# EasyEDA Pro project 课设PCB设计.eprj

# Schematic Schematic1
Board Name: Board1; Create Date: 2025-07-07; Page Name: P1; Project Name: 课设PCB设计; Schematic Name: Schematic1; Update Date: 2025-07-07; Company: 嘉立创EDA; Page Size: A4; Version: V1.0
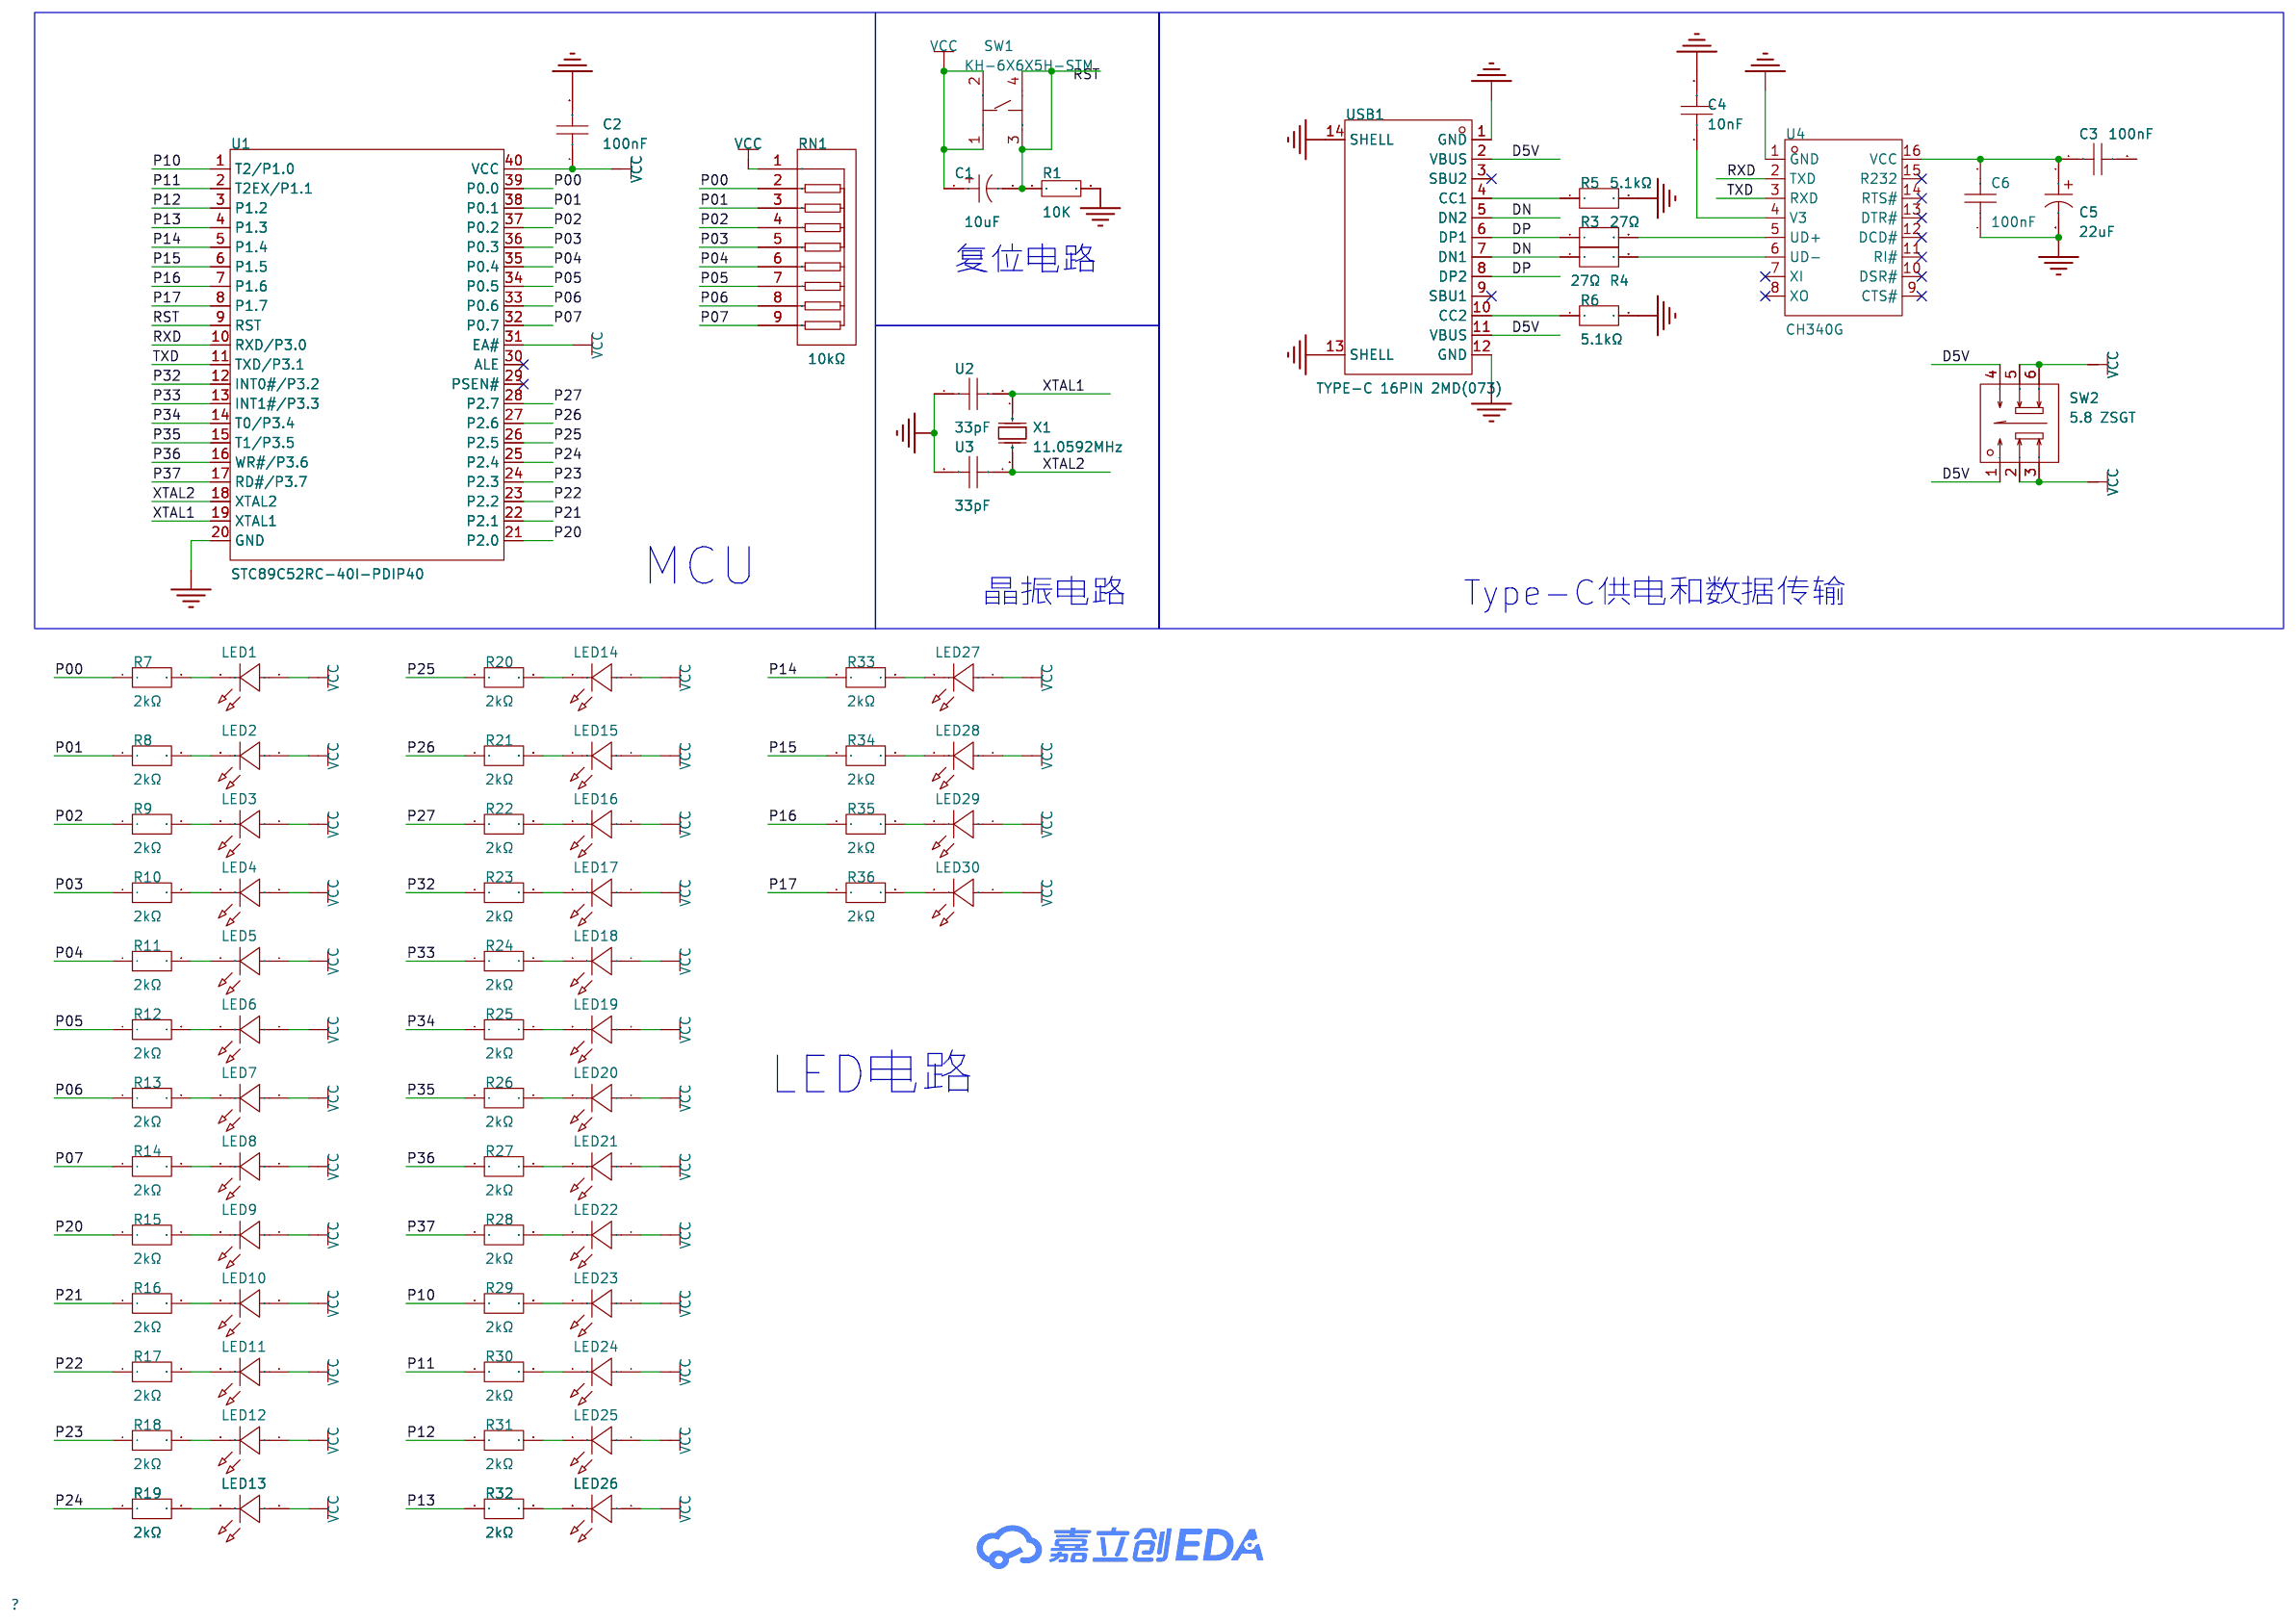
[diagram p0: schematic sheet]

## Parts
C1  10uF  [CAP-TH_BD10.0-P5.00-D0.6-FD_1]
C2  100nF  [C0603]
C3  100nF  [C0603]
C4  10nF  [C0603]
C5  22uF  [CAP-SMD_BD5.0-L5.3-W5.3-LS6.0-FD-H5.7]
C6  100nF  [C0603]
LED1  L-7113SGC  [LED-TH_BD5.9-P2.54-FD]
LED2  L-7113SGC  [LED-TH_BD5.9-P2.54-FD]
LED3  L-7113SGC  [LED-TH_BD5.9-P2.54-FD]
LED4  L-7113SGC  [LED-TH_BD5.9-P2.54-FD]
LED5  L-7113SGC  [LED-TH_BD5.9-P2.54-FD]
LED6  L-7113SGC  [LED-TH_BD5.9-P2.54-FD]
LED7  L-7113SGC  [LED-TH_BD5.9-P2.54-FD]
LED8  L-7113SGC  [LED-TH_BD5.9-P2.54-FD]
LED9  L-7113SGC  [LED-TH_BD5.9-P2.54-FD]
LED10  L-7113SGC  [LED-TH_BD5.9-P2.54-FD]
LED11  L-7113SGC  [LED-TH_BD5.9-P2.54-FD]
LED12  L-7113SGC  [LED-TH_BD5.9-P2.54-FD]
LED13  L-7113SGC  [LED-TH_BD5.9-P2.54-FD]
LED14  L-7113SGC  [LED-TH_BD5.9-P2.54-FD]
LED15  L-7113SGC  [LED-TH_BD5.9-P2.54-FD]
LED16  L-7113SGC  [LED-TH_BD5.9-P2.54-FD]
LED17  L-7113SGC  [LED-TH_BD5.9-P2.54-FD]
LED18  L-7113SGC  [LED-TH_BD5.9-P2.54-FD]
LED19  L-7113SGC  [LED-TH_BD5.9-P2.54-FD]
LED20  L-7113SGC  [LED-TH_BD5.9-P2.54-FD]
LED21  L-7113SGC  [LED-TH_BD5.9-P2.54-FD]
LED22  L-7113SGC  [LED-TH_BD5.9-P2.54-FD]
LED23  L-7113SGC  [LED-TH_BD5.9-P2.54-FD]
LED24  L-7113SGC  [LED-TH_BD5.9-P2.54-FD]
LED25  L-7113SGC  [LED-TH_BD5.9-P2.54-FD]
LED26  L-7113SGC  [LED-TH_BD5.9-P2.54-FD]
LED27  L-7113SGC  [LED-TH_BD5.9-P2.54-FD]
LED28  L-7113SGC  [LED-TH_BD5.9-P2.54-FD]
LED29  L-7113SGC  [LED-TH_BD5.9-P2.54-FD]
LED30  L-7113SGC  [LED-TH_BD5.9-P2.54-FD]
R1  10K  [R0603]
R3  27Ω  [R0805]
R4  27Ω  [R0805]
R5  5.1kΩ  [R0603]
R6  5.1kΩ  [R0603]
R7  2kΩ  [R0402]
R8  2kΩ  [R0402]
R9  2kΩ  [R0402]
R10  2kΩ  [R0402]
R11  2kΩ  [R0402]
R12  2kΩ  [R0402]
R13  2kΩ  [R0402]
R14  2kΩ  [R0402]
R15  2kΩ  [R0402]
R16  2kΩ  [R0402]
R17  2kΩ  [R0402]
R18  2kΩ  [R0402]
R19  2kΩ  [R0402]
R20  2kΩ  [R0402]
R21  2kΩ  [R0402]
R22  2kΩ  [R0402]
R23  2kΩ  [R0402]
R24  2kΩ  [R0402]
R25  2kΩ  [R0402]
R26  2kΩ  [R0402]
R27  2kΩ  [R0402]
R28  2kΩ  [R0402]
R29  2kΩ  [R0402]
R30  2kΩ  [R0402]
R31  2kΩ  [R0402]
R32  2kΩ  [R0402]
R33  2kΩ  [R0402]
R34  2kΩ  [R0402]
R35  2kΩ  [R0402]
R36  2kΩ  [R0402]
RN1  10kΩ  [RES-ARRAY-TH_9P-P2.54-D1.0]
SW1  KH-6X6X5H-STM  [SW-SMD_4P-L6.0-W6.0-P4.50-LS9.0_H5.0]
SW2  5.8 ZSGT  [SW-TH_5.8ZSGT]
U1  STC89C52RC-40I-PDIP40  [DIP-40_L52.0-W13.7-P2.54-LS15.2-BL]
U2  33pF  [C0603]
U3  33pF  [C0603]
U4  CH340G  [SOIC-16_L9.9-W3.9-P1.27-LS6.0-BL]
USB1  TYPE-C 16PIN 2MD(073)  [USB-C-SMD_TYPE-C-6PIN-2MD-073]
X1  11.0592MHz  [HC-49US_L11.5-W4.5-P4.88]

## Library data of the parts
C1 = CV100MPA16B: 容值:10uF;精度:±20%;额定电压:450V;纹波电流:200mA@100kHz;等效串联电阻(ESR):9Ω@100kHz;; LCSC Part Name: 10uF ±20% 450V; Supplier Part: C911241; Manufacturer: TWBOR(伯鸿); Supplier Footprint: 插件,D10xL16mm; JLCPCB Part Class: 扩展库; Datasheet: https://atta.szlcsc.com/upload/public/pdf/source/20201117/C911241_08C53D140102C9DE5D4425A5E1B3FE4F.pdf; Supplier: LCSC; Tolerance: ±20%; Voltage Rating: 450V; Ripple Current: 200mA@100kHz; Equivalent Series Resistance(ESR): 9Ω@100kHz; Pin Spacing: 5mm; Diameter: 10mm; Height - Seated (Max): 16mm; Lifetime: 5000hrs@105℃; Operating Temperature: -25℃~+105℃
C2 C3 C6 = 0603X7R104K250NT: 容值:100nF;精度:±10%;额定电压:25V;温度系数:X7R;; LCSC Part Name: 100nF ±10% 25V; Supplier Part: C48579280; Manufacturer: AIDE(爱迪电容); Supplier Footprint: 0603; JLCPCB Part Class: 扩展库; Datasheet: https://atta.szlcsc.com/upload/public/pdf/source/20210330/C2691711_5D01E1D4D7BF54205139C8425089DFE9.pdf; Supplier: LCSC; Tolerance: ±10%; Voltage Rating: 25V; Temperature Coefficient: X7R
C4 = C0603X103K2RECAUTO: 容值:10nF;精度:±10%;额定电压:200V;温度系数:X7R;; LCSC Part Name: 10nF ±10% 200V; Supplier Part: C2179446; Manufacturer: KEMET(基美); Supplier Footprint: 0603; JLCPCB Part Class: 扩展库; Datasheet: https://atta.szlcsc.com/upload/public/pdf/source/20210401/9EB15DD54C62581D346AFC10D664EB43.pdf; Supplier: LCSC; Tolerance: ±10%; Voltage Rating: 200V; Temperature Coefficient: X7R
C5 = JVE35V22M5X6: 容值:22uF;精度:±20%;额定电压:35V;纹波电流:95mA@120Hz;等效串联电阻(ESR):1.8Ω;; LCSC Part Name: 22uF ±20% 35V; Supplier Part: C48615118; Manufacturer: 捷而瑞; Supplier Footprint: SMD,D5xL5.7mm; JLCPCB Part Class: 扩展库; Datasheet: https://atta.szlcsc.com/upload/public/pdf/source/20250526/77E8EF678E4424190D47C2A54E1D535C.pdf; Supplier: LCSC; Tolerance: ±20%; Voltage Rating: 35V; Ripple Current: 95mA@120Hz; Equivalent Series Resistance(ESR): 1.8Ω; Diameter: 5mm; Height - Seated (Max): 5.7mm; Operating Temperature: -55℃~+105℃
LED1-LED30 = L-7113SGC: Supplier Part: C598455; Manufacturer: Kingbright; Supplier Footprint: 插件; JLCPCB Part Class: 扩展库; Datasheet: https://atta.szlcsc.com/upload/public/pdf/source/20250423/1662BB5EE7BFA789B9DB59295C7166F0.pdf; Supplier: LCSC
R1 = Res_0603: Supplier Footprint: 0603
R3 R4 = FRC0805J270 TS: 电阻类型:厚膜电阻;阻值:27Ω;精度:±5%;功率:125mW;工作电压:150V;温度系数:±100ppm/℃;; LCSC Part Name: 27Ω ±5% 125mW 厚膜电阻; Supplier Part: C2907314; Manufacturer: FOJAN(富捷); Supplier Footprint: 0805; JLCPCB Part Class: 扩展库; Datasheet: https://atta.szlcsc.com/upload/public/pdf/source/20211221/925EC7D7225764EE0046F22065062C87.pdf; Supplier: LCSC; Type: 厚膜电阻; Tolerance: ±5%; Power(Watts): 125mW; Voltage-Supply(Max): 150V; Temperature Coefficient: ±100ppm/℃; Operating Temperature: -55℃~+155℃
R5 R6 = RNCF0603TKW5K10: 电阻类型:薄膜电阻;阻值:5.1kΩ;精度:±0.01%;功率:100mW;温度系数:±2ppm/℃;; LCSC Part Name: 薄膜电阻 5.1kΩ ±0.01% 100mW; Supplier Part: C5863831; Manufacturer: SEI(Stackpole Electronics Inc.); Supplier Footprint: 0603; JLCPCB Part Class: 扩展库; Datasheet: https://atta.szlcsc.com/upload/public/pdf/source/20240328/A43EC6CDE744F29FBC58E37E114A4DE1.pdf; Supplier: LCSC; Type: 薄膜电阻; Tolerance: ±0.01%; Power(Watts): 100mW; Temperature Coefficient: ±2ppm/℃; Operating Temperature: -55℃~+155℃
R7-R36 = RCS04022K00FKED: LCSC Part Name: 厚膜电阻 2kΩ ±1% 200mW; Supplier Part: C2085948; Manufacturer: VISHAY(威世); Supplier Footprint: 0402; Datasheet: https://atta.szlcsc.com/upload/public/pdf/source/20210503/0CC639779AE1E6CD65C23C0020C9E501.pdf; Supplier: LCSC; Type: 厚膜电阻; Tolerance: ±1%; Power(Watts): 200mW; Voltage-Supply(Max): 50V; Temperature Coefficient: ±100ppm/℃; Operating Temperature: -55℃~+155℃
RN1 = 排阻 10 K 5%: LCSC Part Name: 10KΩ (103) ±5%; Supplier Part: C26615; Supplier Footprint: 插件; JLCPCB Part Class: 扩展库; Supplier: LCSC
SW1 = KH-6X6X5H-STM: 电路结构:单刀单掷;按钮形状:圆形按钮;安装方式:立贴;开关长度:6mm;开关宽度:6mm;开关高度:5mm;带支架:不带;触点电流:50mA;额定电压(DC):12V;机械寿命:8万次;; LCSC Part Name: 6*6*5mm 立贴 轻触开关; Supplier Part: C2837531; Manufacturer: kinghelm(金航标); Supplier Footprint: SMD; JLCPCB Part Class: 扩展库; Datasheet: https://atta.szlcsc.com/upload/public/pdf/source/20210608/C2837531_45E87AB996CE723B09405FF2EA209C4C.pdf; Supplier: LCSC; Circuit: 单刀单掷; Actuator Style: 圆形按钮; Mounting Style: 立贴; Switch Length: 6mm; Switch Width: 6mm; Switch Height: 5mm; Strike Gundam: 不带; Contact Current: 50mA; Voltage Rating (DC): 12V; Actuator/Cap Color: 黑色; Pin Style: 鸥翼型; Mechanical Life: 8万次
SW2 = 5.8 ZSGT: 电路结构:双刀双掷;自锁/无锁:自锁;安装方式:直插;触点电流:110mA;额定电压 (DC):30V;带灯:不带;作用力:1.5N;机械寿命:10万次;; LCSC Part Name: 5.8*5.8有头/高头 带锁/自锁开关 泡泡机开关; Supplier Part: C2681587; Manufacturer: SHOU HAN(首韩); Supplier Footprint: 插件; JLCPCB Part Class: 扩展库; Datasheet: https://atta.szlcsc.com/upload/public/pdf/source/20210107/C2681587_CDDDDA4A1C7AC9FEB01815B75893A6BA.pdf; Supplier: LCSC; Circuit: 双刀双掷; Self Lock / No Lock: 自锁; Actuator Style: 方形按钮; Mounting Style: 直插; Contact Current: 110mA; Voltage Rating (DC): 30V; Insulation Resistance: 100MΩ; Actuator/Cap Color: 白色; With Lamp: 不带; Pin Style: PC引脚; Operating Force: 1.5N; Operating Temperature: -10℃~+70℃; Mechanical Life: 10万次
U1 = STC89C52RC-40I-PDIP40: Supplier Part: C14022; Manufacturer: STC; Supplier Footprint: DIP-40; JLCPCB Part Class: 扩展库; Datasheet: https://atta.szlcsc.com/upload/public/pdf/source/20250219/C2F0DDDE7C5E9ADA5B33742D18630F09.pdf; Supplier: LCSC; CPU Core: 51系列; Program Storage Size: 8KB; Program Memory Type: FLASH; Number of I/O: 35; Voltage - Supply: 3.3V~5.5V
U2 U3 = GRM1885C1H330FA01D: 容值:33pF;精度:±1%;额定电压:50V;温度系数:-;; LCSC Part Name: 33pF ±1% 50V; Supplier Part: C882522; Manufacturer: muRata(村田); Supplier Footprint: 0603; JLCPCB Part Class: 扩展库; Datasheet: https://atta.szlcsc.com/upload/public/pdf/source/20200305/C490387_23319AE8C154DEB24C505E6C82A8106A.pdf; Supplier: LCSC; Tolerance: ±1%; Voltage Rating: 50V
U4 = CH340G: 应用功能:USB转UART;接口协议:USB 2.0;数据速率:2Mbps;; LCSC Part Name: USB转串口芯片CH340; Supplier Part: C14267; Manufacturer: WCH(南京沁恒); Supplier Footprint: SOP-16; JLCPCB Part Class: 扩展库; Datasheet: https://atta.szlcsc.com/upload/public/pdf/source/20240313/8510303D24D987FBF1AD30058571F10E.pdf; Supplier: LCSC; Applications Function: USB转UART; Protocol: USB 2.0; Supply Voltage: 5V；3.3V; Data Rate: 2Mbps; Operating Temperature: -40℃~+85℃
USB1 = TYPE-C 16PIN 2MD(073): 连接器类型:Type-C;协议标准:USB 3.1;公母:母;安装方式:卧贴;触点数量:16P;端口数量:1;额定电流 - 电源:3A;工作温度:-25℃~+85℃;; LCSC Part Name: Type-C 母 卧贴; Supplier Part: C2765186; Manufacturer: SHOU HAN(首韩); Supplier Footprint: SMD; JLCPCB Part Class: 扩展库; Datasheet: https://atta.szlcsc.com/upload/public/pdf/source/20250506/FFB74EDFDFA0AC372CE4A8E4F739CCEF.pdf; Supplier: LCSC; Connector Type: Type-C; Protocol Standard: USB 3.1; Gender: 母; Mounting Type: 卧贴; Number of Contacts: 16P; Number of Ports: 1; Current Rating-Power: 3A; Voltage Rating: 5V; Connect-Disconnect Life: 5千次; Detection color: 黑色; Operating Temperature: -25℃~+85℃
X1 = X49SD110592MSD2SC: 晶振类型:直插晶振;频率:11.0592MHz;常温频差:±20ppm;负载电容:20pF;频率稳定度:±30ppm;; LCSC Part Name: HC-49US 11.0592MHZ 2P 49S 20PF ±20PPM -20~70℃（±30PPM）; Supplier Part: C2203; Manufacturer: YXC(扬兴晶振); Supplier Footprint: HC-49S; JLCPCB Part Class: 扩展库; Datasheet: https://atta.szlcsc.com/upload/public/pdf/source/20240329/977D7F2434F98B2BE33270BB9FF3D86D.pdf; Supplier: LCSC; Type: 直插晶振; Normal temperature Frequency Tolerance: ±20ppm; Load Capacitance: 20pF; Frequency Stability: ±30ppm; Operating Temperature: -20℃~+70℃

## Nets
D5V: SW2.1 SW2.4 USB1.2(VBUS) USB1.11(VBUS)
GND: C2.2 C4.2 C5.2 C6.1 R1.2 R5.2 R6.2 U1.20(GND) U2.1 U3.2 U4.1(GND) USB1.1(GND) USB1.12(GND) USB1.13(SHELL) USB1.14(SHELL)
VCC: C1.1 C2.1 LED1.1 LED2.1 LED3.1 LED4.1 LED5.1 LED6.1 LED7.1 LED8.1 LED9.1 LED10.1 LED11.1 LED12.1 LED13.1 LED14.1 LED15.1 LED16.1 LED17.1 LED18.1 LED19.1 LED20.1 LED21.1 LED22.1 LED23.1 LED24.1 LED25.1 LED26.1 LED27.1 LED28.1 LED29.1 LED30.1 RN1.1 SW1.1 SW1.2 SW2.2 SW2.3 SW2.5 SW2.6 U1.31(EA#) U1.40(VCC)
DN: R4.1 USB1.5(DN2) USB1.7(DN1)
DP: R3.1 USB1.6(DP1) USB1.8(DP2)
P00: R7.1 RN1.2 U1.39(P0.0)
P01: R8.1 RN1.3 U1.38(P0.1)
P02: R9.1 RN1.4 U1.37(P0.2)
P03: R10.1 RN1.5 U1.36(P0.3)
P04: R11.1 RN1.6 U1.35(P0.4)
P05: R12.1 RN1.7 U1.34(P0.5)
P06: R13.1 RN1.8 U1.33(P0.6)
P07: R14.1 RN1.9 U1.32(P0.7)
P10: R29.1 U1.1(T2/P1.0)
P11: R30.1 U1.2(T2EX/P1.1)
P12: R31.1 U1.3(P1.2)
P13: R32.1 U1.4(P1.3)
P14: R33.1 U1.5(P1.4)
P15: R34.1 U1.6(P1.5)
P16: R35.1 U1.7(P1.6)
P17: R36.1 U1.8(P1.7)
P20: R15.1 U1.21(P2.0)
P21: R16.1 U1.22(P2.1)
P22: R17.1 U1.23(P2.2)
P23: R18.1 U1.24(P2.3)
P24: R19.1 U1.25(P2.4)
P25: R20.1 U1.26(P2.5)
P26: R21.1 U1.27(P2.6)
P27: R22.1 U1.28(P2.7)
P32: R23.1 U1.12(INT0#/P3.2)
P33: R24.1 U1.13(INT1#/P3.3)
P34: R25.1 U1.14(T0/P3.4)
P35: R26.1 U1.15(T1/P3.5)
P36: R27.1 U1.16(WR#/P3.6)
P37: R28.1 U1.17(RD#/P3.7)
RST: C1.2 R1.1 SW1.3 SW1.4 U1.9(RST)
RXD: U1.10(RXD/P3.0) U4.2(TXD)
TXD: U1.11(TXD/P3.1) U4.3(RXD)
XTAL1: U1.19(XTAL1) U2.2 X1.1(OSC1)
XTAL2: U1.18(XTAL2) U3.1 X1.2(OSC2)
$1N1798: R5.1 USB1.4(CC1)
$1N1799: R6.1 USB1.10(CC2)
$1N1802: R3.2 U4.5(UD+)
$1N1803: R4.2 U4.6(UD-)
$1N1804: C4.1 U4.4(V3)
$1N1817: C3.1 C5.1 C6.2 U4.16(VCC)
$1N1968: LED1.2 R7.2
$1N2162: LED2.2 R8.2
$1N2248: LED3.2 R9.2
$1N2334: LED4.2 R10.2
$1N2420: LED5.2 R11.2
$1N2506: LED6.2 R12.2
$1N2592: LED7.2 R13.2
$1N2678: LED8.2 R14.2
$1N2764: LED9.2 R15.2
$1N2850: LED10.2 R16.2
$1N2936: LED11.2 R17.2
$1N3022: LED12.2 R18.2
$1N3108: LED13.2 R19.2
$1N4130: LED14.2 R20.2
$1N4137: LED15.2 R21.2
$1N4144: LED16.2 R22.2
$1N4151: LED17.2 R23.2
$1N4158: LED18.2 R24.2
$1N4165: LED19.2 R25.2
$1N4172: LED20.2 R26.2
$1N4179: LED21.2 R27.2
$1N4186: LED22.2 R28.2
$1N4193: LED23.2 R29.2
$1N4200: LED24.2 R30.2
$1N4207: LED25.2 R31.2
$1N4214: LED26.2 R32.2
$1N4546: LED27.2 R33.2
$1N4553: LED28.2 R34.2
$1N4560: LED29.2 R35.2
$1N4567: LED30.2 R36.2

Not connected (* = marked no-connect by the designer): C3 2; U1 29(PSEN#)* 30(ALE)*; U4 7(XI)* 8(XO)* 9(CTS#)* 10(DSR#)* 11(RI#)* 12(DCD#)* 13(DTR#)* 14(RTS#)* 15(R232)*; USB1 3(SBU2)* 9(SBU1)*

## Notes on the sheet
- 复位电路
- MCU
- 晶振电路
- Type-C供电和数据传输
- LED电路

# Board PCB1
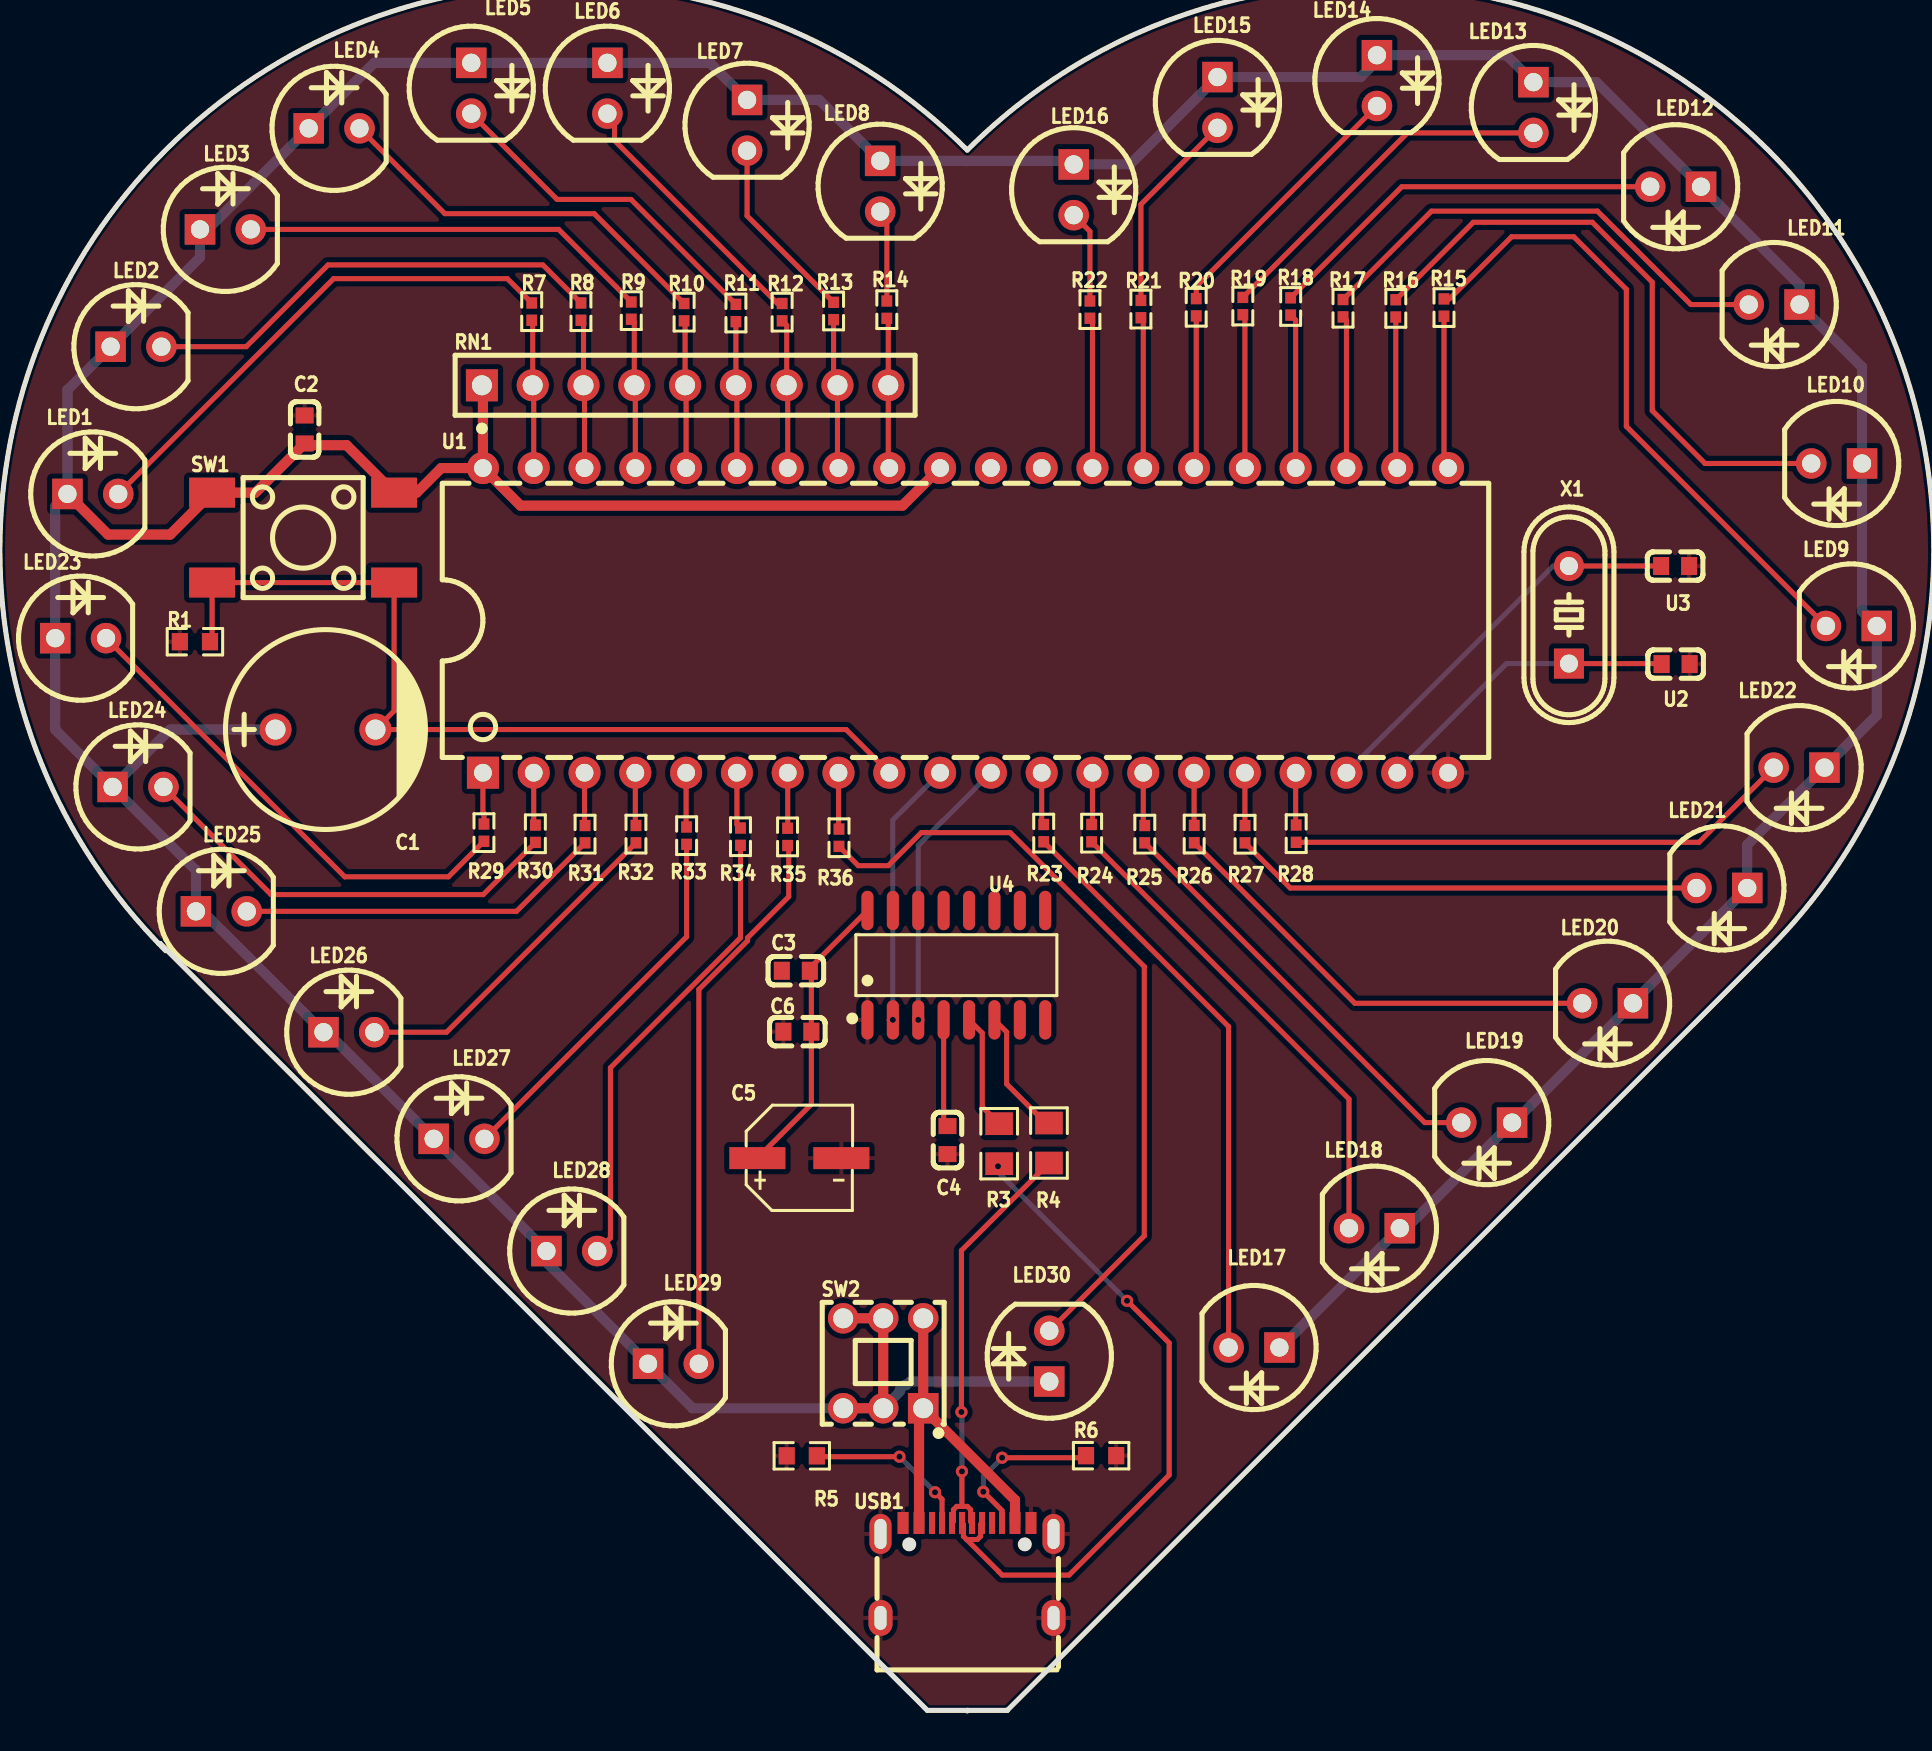
[diagram p1: board, top side]
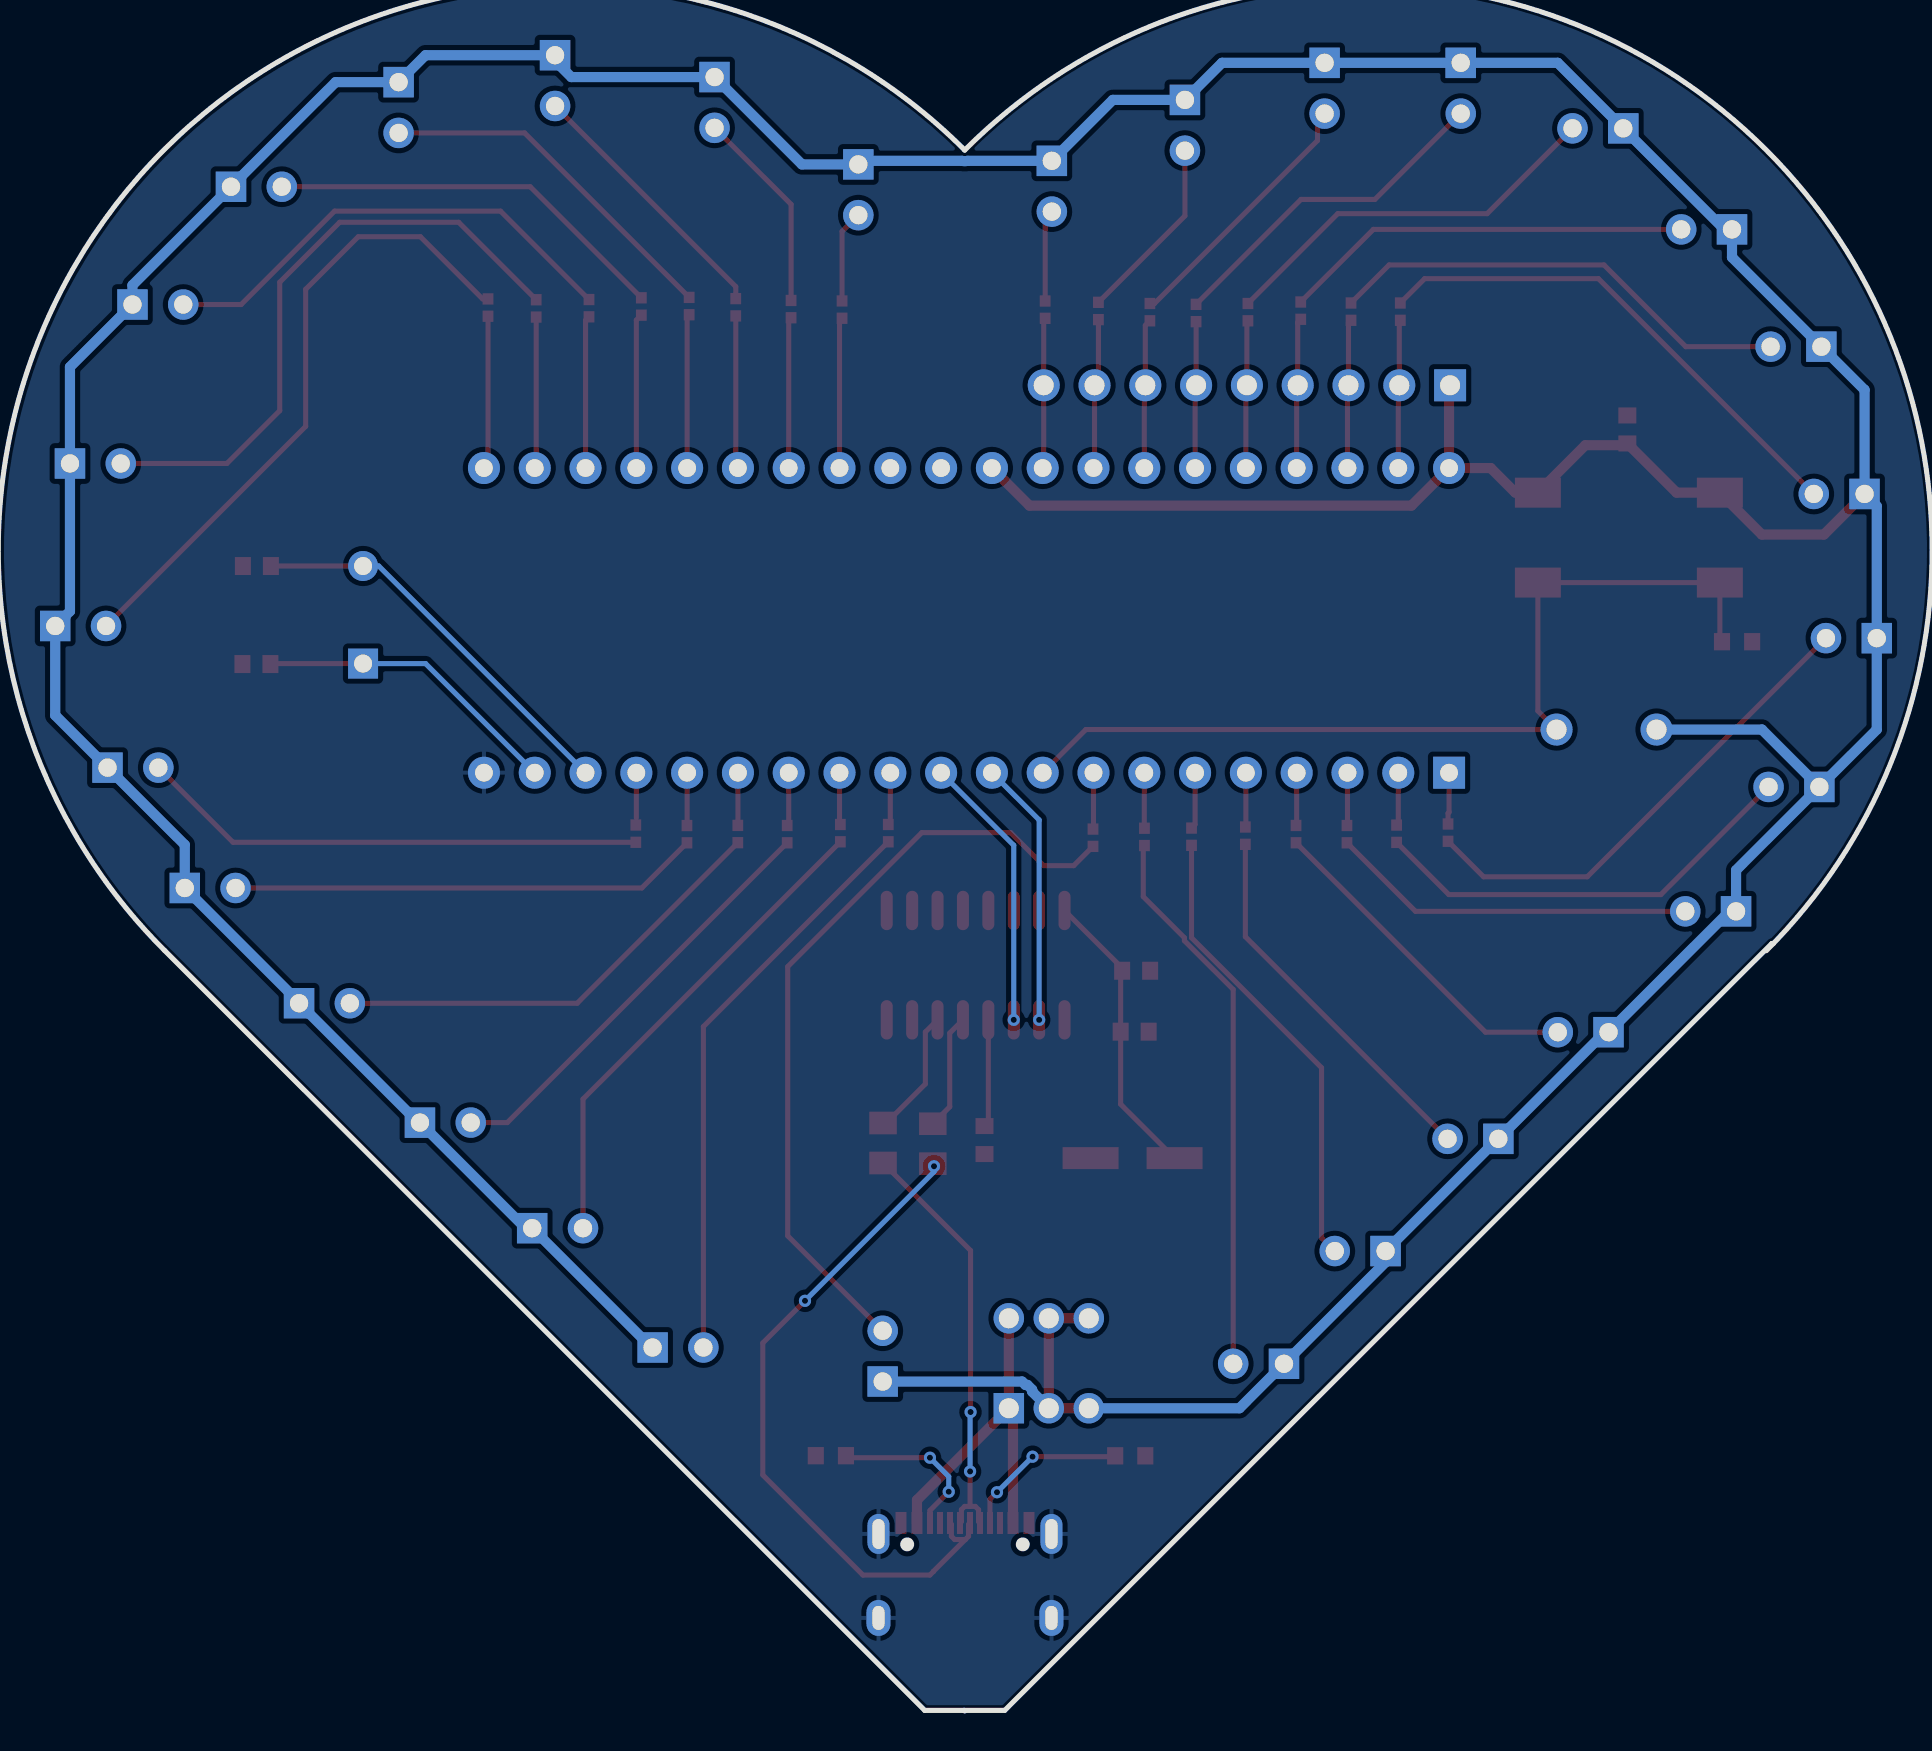
[diagram p2: board, bottom side, seen from below]

Outline 96.67 x 86.39 mm; copper layers: Top Layer, Bottom Layer. Coordinates in mm from the lower left corner of the outline.
Outline path: 7.93,38.39 8.01,38.39 46.37,0.03 48.4,0.03 ; 8.28,38.03 arc(8.3,78.1) 48.37,78.08 arc(88.39,78.05) 88.37,38.03 50.37,0.03 50.37,0.03 48.4,0.03 ; 48.37,0 48.4,0.03
Stack: Top Layer 0.035mm / Dielectric1 1.51mm FR4 er 4.5 / Bottom Layer 0.035mm

## Design rules (mm)
template: JLCPCB Capability(Two Layers Board)
spacing copperThickness1oz (default): track to track 0.102, other pairs 0.152 to 0.3
spacing copperThickness2oz: track to track 0.203, other pairs 0.152 to 0.3
track width copperThickness1oz (default): min 0.127, default 0.254, max 2.54
track width copperThickness2oz: min 0.203, default 0.254, max 2.54
differential pair differentialPair (default): width min 0.127, default 0.254, max 2.54; gap min 0.152, default 0.152
via viaSize (default): diameter min 0.5, default 0.61, max 10; hole min 0.3, default 0.305, max 6.3

## Placement (name value [footprint] x y rotation side)
C1  10uF  [CAP-TH_BD10.0-P5.00-D0.6-FD_1]  16.27 49.09 0 top
C2  100nF  [C0603]  15.23 64.11 90 top
C3  100nF  [C0603]  39.8 37.03 180 top
C4  10nF  [C0603]  47.38 28.56 270 top
C5  22uF  [CAP-SMD_BD5.0-L5.3-W5.3-LS6.0-FD-H5.7]  39.97 27.66 0 top
C6  100nF  [C0603]  39.87 33.98 0 top
LED1  L-7113SGC  [LED-TH_BD5.9-P2.54-FD]  4.64 60.88 0 top
LED2  L-7113SGC  [LED-TH_BD5.9-P2.54-FD]  6.8 68.25 0 top
LED3  L-7113SGC  [LED-TH_BD5.9-P2.54-FD]  11.27 74.11 0 top
LED4  L-7113SGC  [LED-TH_BD5.9-P2.54-FD]  16.71 79.17 0 top
LED5  L-7113SGC  [LED-TH_BD5.9-P2.54-FD]  23.56 81.17 270 top
LED6  L-7113SGC  [LED-TH_BD5.9-P2.54-FD]  30.37 81.17 270 top
LED7  L-7113SGC  [LED-TH_BD5.9-P2.54-FD]  37.36 79.32 270 top
LED8  L-7113SGC  [LED-TH_BD5.9-P2.54-FD]  44.01 76.27 270 top
LED9  L-7113SGC  [LED-TH_BD5.9-P2.54-FD]  92.58 54.28 180 top
LED10  L-7113SGC  [LED-TH_BD5.9-P2.54-FD]  91.84 62.4 180 top
LED11  L-7113SGC  [LED-TH_BD5.9-P2.54-FD]  88.72 70.35 180 top
LED12  L-7113SGC  [LED-TH_BD5.9-P2.54-FD]  83.79 76.25 180 top
LED13  L-7113SGC  [LED-TH_BD5.9-P2.54-FD]  76.68 80.21 270 top
LED14  L-7113SGC  [LED-TH_BD5.9-P2.54-FD]  68.85 81.56 270 top
LED15  L-7113SGC  [LED-TH_BD5.9-P2.54-FD]  60.88 80.46 270 top
LED16  L-7113SGC  [LED-TH_BD5.9-P2.54-FD]  53.69 76.09 270 top
LED17  L-7113SGC  [LED-TH_BD5.9-P2.54-FD]  62.71 18.18 180 top
LED18  L-7113SGC  [LED-TH_BD5.9-P2.54-FD]  68.73 24.15 180 top
LED19  L-7113SGC  [LED-TH_BD5.9-P2.54-FD]  74.34 29.43 180 top
LED20  L-7113SGC  [LED-TH_BD5.9-P2.54-FD]  80.38 35.4 180 top
LED21  L-7113SGC  [LED-TH_BD5.9-P2.54-FD]  86.1 41.17 180 top
LED22  L-7113SGC  [LED-TH_BD5.9-P2.54-FD]  89.96 47.19 180 top
LED23  L-7113SGC  [LED-TH_BD5.9-P2.54-FD]  4.03 53.67 0 top
LED24  L-7113SGC  [LED-TH_BD5.9-P2.54-FD]  6.9 46.22 0 top
LED25  L-7113SGC  [LED-TH_BD5.9-P2.54-FD]  11.07 40 0 top
LED26  L-7113SGC  [LED-TH_BD5.9-P2.54-FD]  17.44 33.96 0 top
LED27  L-7113SGC  [LED-TH_BD5.9-P2.54-FD]  22.95 28.62 0 top
LED28  L-7113SGC  [LED-TH_BD5.9-P2.54-FD]  28.59 23.01 0 top
LED29  L-7113SGC  [LED-TH_BD5.9-P2.54-FD]  33.67 17.37 0 top
LED30  L-7113SGC  [LED-TH_BD5.9-P2.54-FD]  52.47 17.75 90 top
R1  10K  [R0603]  9.75 53.49 180 top
R3  27Ω  [R0805]  49.96 28.38 90 top
R4  27Ω  [R0805]  52.45 28.41 90 top
R5  5.1kΩ  [R0603]  40.09 12.76 180 top
R6  5.1kΩ  [R0603]  55.06 12.77 0 top
R7  2kΩ  [R0402]  26.59 70 90 top
R8  2kΩ  [R0402]  29.05 70 90 top
R9  2kΩ  [R0402]  31.57 70.05 90 top
R10  2kΩ  [R0402]  34.21 69.97 90 top
R11  2kΩ  [R0402]  36.8 69.93 90 top
R12  2kΩ  [R0402]  39.11 69.97 90 top
R13  2kΩ  [R0402]  41.68 70.03 90 top
R14  2kΩ  [R0402]  44.34 70.1 90 top
R15  2kΩ  [R0402]  72.21 70.2 90 top
R16  2kΩ  [R0402]  69.8 70.16 90 top
R17  2kΩ  [R0402]  67.16 70.17 90 top
R18  2kΩ  [R0402]  64.54 70.26 90 top
R19  2kΩ  [R0402]  62.15 70.28 90 top
R20  2kΩ  [R0402]  59.82 70.22 90 top
R21  2kΩ  [R0402]  57.05 70.13 90 top
R22  2kΩ  [R0402]  54.5 70.1 90 top
R23  2kΩ  [R0402]  52.19 43.91 270 top
R24  2kΩ  [R0402]  54.59 43.91 270 top
R25  2kΩ  [R0402]  57.24 43.86 270 top
R26  2kΩ  [R0402]  59.71 43.87 270 top
R27  2kΩ  [R0402]  62.26 43.86 270 top
R28  2kΩ  [R0402]  64.81 43.89 270 top
R29  2kΩ  [R0402]  24.2 43.94 270 top
R30  2kΩ  [R0402]  26.77 43.88 270 top
R31  2kΩ  [R0402]  29.25 43.86 270 top
R32  2kΩ  [R0402]  31.8 43.86 270 top
R33  2kΩ  [R0402]  34.33 43.79 270 top
R34  2kΩ  [R0402]  37.03 43.73 270 top
R35  2kΩ  [R0402]  39.38 43.72 270 top
R36  2kΩ  [R0402]  41.95 43.68 270 top
RN1  10kΩ  [RES-ARRAY-TH_9P-P2.54-D1.0]  34.26 66.32 0 top
SW1  KH-6X6X5H-STM  [SW-SMD_4P-L6.0-W6.0-P4.50-LS9.0_H5.0]  15.16 58.7 0 top
SW2  5.8 ZSGT  [SW-TH_5.8ZSGT]  44.16 17.4 0 top
U1  STC89C52RC-40I-PDIP40  [DIP-40_L52.0-W13.7-P2.54-LS15.2-BL]  48.28 54.55 0 top
U2  33pF  [C0603]  83.79 52.37 180 top
U3  33pF  [C0603]  83.76 57.27 0 top
U4  CH340G  [SOIC-16_L9.9-W3.9-P1.27-LS6.0-BL]  47.82 37.31 0 top
USB1  TYPE-C 16PIN 2MD(073)  [USB-C-SMD_TYPE-C-6PIN-2MD-073]  48.35 7.03 0 top
X1  11.0592MHz  [HC-49US_L11.5-W4.5-P4.88]  78.45 54.83 90 top

## Footprints (pads in the part's own frame, mm; a bottom-side part is the same pattern mirrored in y, then rotated)
C0603
  rect 0.8x0.9 smd: 1(-0.7,0) 2(0.7,0)
CAP-SMD_BD5.0-L5.3-W5.3-LS6.0-FD-H5.7
  rect 2.8x1.1 smd: 1(-2.1,0) 2(2.1,0)
CAP-TH_BD10.0-P5.00-D0.6-FD_1
  round 1.6 hole 1: 1(-2.5,0) 2(2.5,0)
DIP-40_L52.0-W13.7-P2.54-LS15.2-BL
  rect 1.6x1.6 hole 0.889: 1(-24.13,-7.62)
  round 1.6 hole 0.889: 2(-21.59,-7.62) 3(-19.05,-7.62) 4(-16.51,-7.62) 5(-13.97,-7.62) 6(-11.43,-7.62) 7(-8.89,-7.62) 8(-6.35,-7.62) 9(-3.81,-7.62) 10(-1.27,-7.62) 11(1.27,-7.62) 12(3.81,-7.62) 13(6.35,-7.62) 14(8.89,-7.62) 15(11.43,-7.62) 16(13.97,-7.62) 17(16.51,-7.62) 18(19.05,-7.62) 19(21.59,-7.62) 20(24.13,-7.62) 21(24.13,7.62) 22(21.59,7.62) 23(19.05,7.62) 24(16.51,7.62) 25(13.97,7.62) 26(11.43,7.62) 27(8.89,7.62) 28(6.35,7.62) 29(3.81,7.62) 30(1.27,7.62) 31(-1.27,7.62) 32(-3.81,7.62) 33(-6.35,7.62) 34(-8.89,7.62) 35(-11.43,7.62) 36(-13.97,7.62) 37(-16.51,7.62) 38(-19.05,7.62) 39(-21.59,7.62) 40(-24.13,7.62)
HC-49US_L11.5-W4.5-P4.88
  rect 1.5x1.5 hole 0.9: 1(-2.44,0)
  round 1.5 hole 0.9: 2(2.44,0)
LED-TH_BD5.9-P2.54-FD
  rect 1.524x1.524 hole 0.914: 1(-1.27,0)
  round 1.524 hole 0.914: 2(1.27,0)
R0402
  rect 0.566x0.54 smd: 1(-0.433,0) 2(0.433,0)
R0603
  rect 0.806x0.864 smd: 1(-0.753,0) 2(0.753,0)
R0805
  rect 1.133x1.377 smd: 1(-1,0) 2(1,0)
RES-ARRAY-TH_9P-P2.54-D1.0
  rect 1.6x1.6 hole 1: 1(-10.16,0)
  round 1.6 hole 1: 2(-7.62,0) 3(-5.08,0) 4(-2.54,0) 5(0,0) 6(2.54,0) 7(5.08,0) 8(7.62,0) 9(10.16,0)
SOIC-16_L9.9-W3.9-P1.27-LS6.0-BL
  oval 0.602x1.971 smd: 1(-4.445,-2.736) 2(-3.175,-2.736) 3(-1.905,-2.736) 4(-0.635,-2.736) 5(0.635,-2.736) 6(1.905,-2.736) 7(3.175,-2.736) 8(4.445,-2.736) 9(4.445,2.736) 10(3.175,2.736) 11(1.905,2.736) 12(0.635,2.736) 13(-0.635,2.736) 14(-1.905,2.736) 15(-3.175,2.736) 16(-4.445,2.736)
SW-SMD_4P-L6.0-W6.0-P4.50-LS9.0_H5.0
  rect 2.3x1.5 smd: 1(-4.55,2.25) 2(4.55,2.25) 3(-4.55,-2.25) 4(4.55,-2.25)
SW-TH_5.8ZSGT
  rect 1.524x1.524 hole 1: 1(2,-2.25)
  round 1.524 hole 1: 2(0,-2.25) 3(-2,-2.25) 4(2,2.25) 5(0,2.25) 6(-2,2.25)
USB-C-SMD_TYPE-C-6PIN-2MD-073
  rect 0.55x1.1 smd: 1(-3.2,2.375) 2(-2.4,2.375) 11(2.4,2.375) 12(3.2,2.375)
  rect 0.3x1.1 smd: 3(-1.75,2.375) 4(-1.25,2.375) 5(-0.75,2.375) 6(-0.25,2.375) 7(0.25,2.375) 8(0.75,2.375) 9(1.25,2.375) 10(1.75,2.375)
  oval 1.1x2 hole 0.6x1.5: 13(-4.325,1.825) 14(4.325,1.825)
  oval 1.2x1.8 hole 0.6x1.2: 13(-4.325,-2.375) 14(4.325,-2.375)

## Nets
As in the schematic.

Pads without a net: C3 2; U1 29 30; U4 7 8 9 10 11 12 13 14 15; USB1 3 9

## Via types
v1: diameter 0.61, hole 0.305, Top Layer to Bottom Layer, 10 vias

## Routing (per net, layer and track width the routed paths; a pad name or vN(x,y) marks a point on that pad's centre or on a via; arc(x,y) is an arc through that point)
D5V: length 18
  Top Layer w0.508: SW2.4 SW2.1 ; SW2.1 45.96,14.94 USB1.2 ; SW2.1 50.75,10.55 USB1.11
VCC: length 323.7
  Top Layer w0.508: SW2.3 SW2.2 SW2.5 SW2.6 ; U1.31 45.13,60.3 26.03,60.3 U1.40 ; LED1.1 5.4,58.85 8.51,58.85 SW1.1 12.77,60.95 C2.1 15.32,63.32 17.33,63.32 SW1.2 20.84,60.94 22.07,62.17 U1.40 ; U1.40 24.15,66.26 RN1.1
  Bottom Layer w0.508: LED24.1 2.76,49.09 LED23.1 2.76,60.27 LED1.1 3.37,66.09 LED2.1 10,72.72 10,74.11 10.38,74.11 LED4.1 18.71,82.44 LED5.1 LED6.1 35.5,82.44 LED7.1 40.96,80.59 LED8.1 48.23,77.54 arc(48.37,77.52) 48.5,77.54 53.51,77.54 LED16.1 56.51,77.36 LED15.1 68.04,81.73 68.74,82.43 68.74,82.94 68.63,83.05 ; LED24.1 9.8,42.06 LED25.1 10.13,40 LED26.1 16.35,33.96 LED27.1 21.71,28.62 LED28.1 27.32,22.45 LED29.1 34.63,15.15 SW2.3 ; LED24.1 8.5,49.09 C1.1 ; LED17.1 64.03,18.18 LED18.1 70.33,24.15 LED19.1 75.68,29.43 LED20.1 81.65,35.45 LED21.1 87.37,43.33 LED22.1 93.85,49.81 LED9.1 93.11,55.01 LED10.1 93.11,67.23 LED11.1 89.99,71.32 LED12.1 79.83,81.48 LED13.1 75.33,82.83 68.85,82.83 ; SW2.2 45,15.98 45,16.07 45.23,16.31 45.33,16.31 45.5,16.48 LED30.1
DN: length 21.4
  Top Layer w0.254: v1(48.08,14.96) 48.08,23.04 R4.1 ; 47.61,9.41 47.68,9.48 47.68,10.07 47.84,10.24 48.13,10.24 ; 48.13,10.24 48.37,10.24 48.53,10.07 48.53,9.48 48.61,9.41 ; 48.13,10.24 48.1,10.26 v1(48.1,11.98)
  Bottom Layer w0.254: v1(48.1,11.98) 48.1,14.93 v1(48.08,14.96)
DP: length 34.3
  Top Layer w0.254: 48.34,8.58 48.18,8.74 48.18,9.34 USB1.6 ; 48.34,8.58 49.93,6.99 49.93,6.98 50.11,6.8 53.46,6.8 58.46,11.81 58.46,18.41 v1(56.36,20.52) ; 48.34,8.58 48.87,8.58 49.03,8.74 49.03,9.34 USB1.8
  Bottom Layer w0.254: v1(56.36,20.52) 49.9,26.97 v1(49.9,27.25)
P00: length 7.4
  Top Layer w0.254: U1.39 26.69,66.26 RN1.2 26.64,69.51 R7.1
P01: length 7.5
  Top Layer w0.254: U1.38 29.23,66.26 RN1.3 29.18,69.44 R8.1
P02: length 7.5
  Top Layer w0.254: U1.37 31.77,66.26 RN1.4 31.72,69.46 R9.1
P03: length 7.4
  Top Layer w0.254: R10.1 34.26,69.49 RN1.5 34.31,66.26 U1.36
P04: length 7.3
  Top Layer w0.254: 36.8,69.5 RN1.6 36.85,66.26 U1.35
P05: length 7.5
  Top Layer w0.254: 39.39,62.17 39.39,66.26 RN1.7 39.34,69.31 R12.1
P06: length 7.5
  Top Layer w0.254: R13.1 41.68,66.51 RN1.8 41.88,62.23 U1.33
P07: length 7.5
  Top Layer w0.254: R14.1 44.42,69.59 RN1.9 44.42,62.23 U1.32
P10: length 2.6
  Top Layer w0.254: U1.1 24.15,44.96 24.2,44.91 R29.1
P11: length 2.7
  Top Layer w0.254: R30.1 26.69,44.4 U1.2
P12: length 2.7
  Top Layer w0.254: U1.3 29.23,44.32 R31.1
P13: length 2.7
  Top Layer w0.254: U1.4 31.77,44.33 R32.1
P14: length 2.7
  Top Layer w0.254: U1.5 34.31,44.24 R33.1
P15: length 2.8
  Top Layer w0.254: R34.1 36.85,44.35 U1.6
P16: length 2.8
  Top Layer w0.254: R35.1 39.39,44.17 39.39,46.94
P17: length 2.8
  Top Layer w0.254: U1.8 41.93,44.14 R36.1
P20: length 7.7
  Top Layer w0.254: R15.1 72.21,62.38 U1.21
P21: length 7.6
  Top Layer w0.254: U1.22 69.8,62.25 R16.1
P22: length 7.6
  Top Layer w0.254: U1.23 67.33,69.57 R17.1
P23: length 7.8
  Top Layer w0.254: U1.24 64.79,69.57 R18.1
P24: length 7.7
  Top Layer w0.254: R19.1 62.25,69.74 U1.25
P25: length 7.7
  Top Layer w0.254: R20.1 59.82,62.28 U1.26
P26: length 7.6
  Top Layer w0.254: 57.05,69.69 57.17,69.58 U1.27
P27: length 7.5
  Top Layer w0.254: U1.28 54.63,69.54 R22.1
P32: length 2.6
  Top Layer w0.254: U1.12 52.09,44.45 R23.1
P33: length 2.6
  Top Layer w0.254: U1.13 54.63,44.39 R24.1
P34: length 2.7
  Top Layer w0.254: U1.14 57.17,44.37 R25.1
P35: length 2.6
  Top Layer w0.254: U1.15 59.71,44.31 R26.1
P36: length 2.6
  Top Layer w0.254: U1.16 62.25,44.3 R27.1
P37: length 2.3
  Top Layer w0.254: U1.17 64.79,44.67
RST: length 46.4
  Top Layer w0.254: R1.1 10.61,53.59 SW1.3 SW1.4 19.71,50.03 C1.2 42.31,49.09 U1.9
RXD: length 13.3
  Bottom Layer w0.254: U1.10 44.65,44.57 v1(44.65,34.57)
TXD: length 13.9
  Bottom Layer w0.254: U1.11 45.92,43.3 v1(45.92,34.57)
XTAL1: length 15.5
  Top Layer w0.254: U2.2 83.06,52.39 X1.1
  Bottom Layer w0.254: U1.19 75.33,52.39 X1.1
XTAL2: length 20
  Top Layer w0.254: X1.2 83.06,57.27
  Bottom Layer w0.254: X1.2 77.67,57.27 U1.18
$1N1798: length 8.3
  Top Layer w0.254: v1(46.75,10.94) 47.11,10.59 47.11,9.41 ; v1(44.98,12.72) 40.89,12.72 40.84,12.76
  Bottom Layer w0.254: v1(46.75,10.94) v1(44.98,12.72)
$1N1799: length 8.3
  Top Layer w0.254: R6.1 54.21,12.67 v1(50.11,12.67) ; v1(49.17,10.97) 50.11,10.03 50.11,9.41
  Bottom Layer w0.254: v1(50.11,12.67) 49.17,11.73 v1(49.17,10.97)
$1N1802: length 5.8
  Top Layer w0.254: U4.5 49.12,33.91 49.12,30.22 R3.2
$1N1803: length 6.4
  Top Layer w0.254: U4.6 50.34,33.96 50.34,31.36 52.29,29.41 R4.2
$1N1804: length 5.4
  Top Layer w0.254: U4.4 47.19,29.45 C4.1
$1N1817: length 14.7
  Top Layer w0.254: U4.16 40.57,37.24 C6.2 40.57,30.36 C5.1
$1N1968: length 25.6
  Top Layer w0.254: 26.59,70.43 25.37,71.65 16.68,71.65 LED1.2
$1N2162: length 23.5
  Top Layer w0.254: 29.05,70.43 27.15,72.33 16.4,72.33 12.31,68.25 LED2.2
$1N2248: length 20.5
  Top Layer w0.254: R9.2 27.93,74.11 LED3.2
$1N2334: length 19.9
  Top Layer w0.254: LED4.2 22.24,74.9 29.71,74.9 34.21,70.41
$1N2420: length 17.2
  Top Layer w0.254: R11.2 31.55,75.61 27.86,75.61 LED5.2
$1N2506: length 13.3
  Top Layer w0.254: LED6.2 30.73,79.55 30.73,78.56 38.88,70.41 39.11,70.41
$1N2592: length 9.4
  Top Layer w0.254: R13.2 37.36,74.79 LED7.2
$1N2678: length 4.6
  Top Layer w0.254: R14.2 44.34,74.67 LED8.2
$1N2764: length 32.5
  Top Layer w0.254: LED9.2 81.32,64.26 81.32,71.12 78.69,73.75 75.58,73.75 72.47,70.63 R15.2
$1N2850: length 31.1
  Top Layer w0.254: LED10.2 85.26,62.4 82.62,65.05 82.62,71.47 79.62,74.47 73.67,74.47 R16.2
$1N2936: length 24.1
  Top Layer w0.254: R17.2 71.58,75.03 79.88,75.03 84.55,70.35 LED11.2
$1N3022: length 20.3
  Top Layer w0.254: R18.2 70.09,76.25 LED12.2
$1N3108: length 17.9
  Top Layer w0.254: R19.2 70.38,78.94 LED13.2
$1N4130: length 13.4
  Top Layer w0.254: LED14.2 59.82,71.25 R20.2
$1N4137: length 10.2
  Top Layer w0.254: R21.2 57.05,75.37 LED15.2
$1N4144: length 4.6
  Top Layer w0.254: R22.2 54.5,74.01 LED16.2
$1N4151: length 29.1
  Top Layer w0.254: LED17.2 61.44,34.23 52.19,43.48
$1N4158: length 24.7
  Top Layer w0.254: 54.59,43.48 67.46,30.61 LED18.2
$1N4165: length 21.6
  Top Layer w0.254: LED19.2 71.24,29.43 R25.2
$1N4172: length 22.7
  Top Layer w0.254: R26.2 67.75,35.4 LED20.2
$1N4179: length 23.5
  Top Layer w0.254: R27.2 64.51,41.17 LED21.2
$1N4186: length 25.4
  Top Layer w0.254: R28.2 84.96,43.45 LED22.2
$1N4193: length 24.6
  Top Layer w0.254: R29.2 22.42,41.73 17.24,41.73 LED23.2
$1N4200: length 21.9
  Top Layer w0.254: R30.2 24.16,40.84 13.56,40.84 LED24.2
$1N4207: length 18.3
  Top Layer w0.254: LED25.2 25.83,40 R31.2
$1N4214: length 17
  Top Layer w0.254: R32.2 22.33,33.96 LED26.2
$1N4546: length 18.9
  Top Layer w0.254: LED27.2 34.33,38.73 R33.2
$1N4553: length 23.3
  Top Layer w0.254: LED28.2 30.52,23.67 30.52,32.18 37.03,38.68 37.03,43.3
$1N4560: length 27.8
  Top Layer w0.254: LED29.2 34.94,36.09 37.38,38.53 37.38,38.68 39.44,40.74 39.44,43.23 R35.2
$1N4567: length 39.3
  Top Layer w0.254: R36.2 42.92,42.29 44.42,42.29 46.07,43.94 50.51,43.94 57.22,37.23 57.22,23.77 LED30.2

## Copper pours and planes (outline as drawn; the poured copper is in the pictures)
GND on Top Layer: -4.5,88.08 106.57,88.08 106.57,-6.23 -4.5,-6.23
GND on Bottom Layer: -10.27,89.94 101.72,89.94 101.72,-3.2 -10.27,-3.2
